# EAGLE design OPBoard (EAGLE 9.4.0)
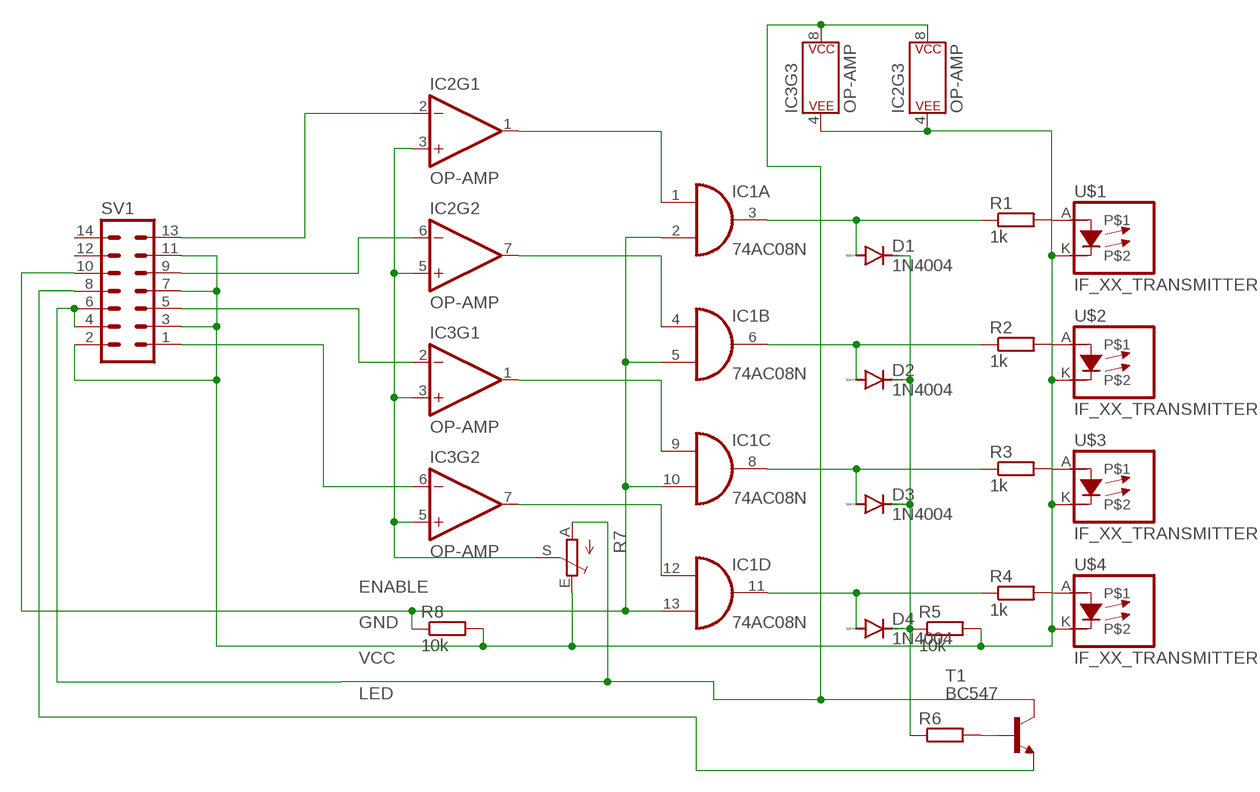
[diagram p0: schematic, sheet 1]

## Parts
D1  1N4004  [DO41-10]
D2  1N4004  [DO41-10]
D3  1N4004  [DO41-10]
D4  1N4004  [DO41-10]
IC1  74AC08N  [DIL14]
IC2  OP-AMP  OPAMP-DUALDIP  [DIP08]
IC3  OP-AMP  OPAMP-DUALDIP  [DIP08]
R1  1k  R-EU_0207/10  [0207/10]
R2  1k  R-EU_0207/10  [0207/10]
R3  1k  R-EU_0207/10  [0207/10]
R4  1k  R-EU_0207/10  [0207/10]
R5  10k  R-EU_0207/10  [0207/10]
R6  R-EU_0207/10  [0207/10]
R7  TRIM_EU-ECP10P  [ECP10P]
R8  10k  R-EU_0207/10  [0207/10]
SV1  MA07-2  [MA07-2]
T1  BC547  [TO92]
U$1  IF_XX_TRANSMITTER  [IF_XX]
U$2  IF_XX_TRANSMITTER  [IF_XX]
U$3  IF_XX_TRANSMITTER  [IF_XX]
U$4  IF_XX_TRANSMITTER  [IF_XX]

## Nets
ENABLE: IC1.2(A:I1) IC1.5(B:I1) IC1.10(C:I1) IC1.13(D:I1) R8.1 SV1.10
GND: IC2.4(P$V-) IC3.4(P$V-) R5.2 R7.E R8.2 SV1.2 SV1.3 SV1.7 SV1.11 U$1.K U$2.K U$3.K U$4.K
LED: SV1.8 T1.1(E)
N$1: R1.2 U$1.A
N$2: R2.2 U$2.A
N$3: R3.2 U$3.A
N$4: R4.2 U$4.A
N$5: D1.A IC1.3(A:O) R1.1
N$6: D2.A IC1.6(B:O) R2.1
N$7: D3.A IC1.8(C:O) R3.1
N$8: D4.A IC1.11(D:O) R4.1
N$9: D1.C D2.C D3.C D4.C R5.1 R6.1
N$10: R6.2 T1.2(B)
N$11: IC2.2(-IN) SV1.13
N$12: IC1.1(A:I0) IC2.1(OUT)
N$13: IC1.4(B:I0) IC2.7(OUT)
N$14: IC1.9(C:I0) IC3.1(OUT)
N$15: IC1.12(D:I0) IC3.7(OUT)
N$16: IC2.3(+IN) IC2.5(+IN) IC3.3(+IN) IC3.5(+IN) R7.S
N$17: IC2.6(-IN) SV1.9
N$18: IC3.2(-IN) SV1.5
N$19: IC3.6(-IN) SV1.1
VCC: IC2.8(P$V+) IC3.8(P$V+) R7.A SV1.4 SV1.6 T1.3(C)
Unconnected: SV1.12 SV1.14

## Power pins joined to a net without a drawn wire
GND: IC1.7(P:GND)
VCC: IC1.14(P:VCC)

## Library data of the parts
D1-D4 = diode:1N4004: DIODE general purpose rectifier, 1 A
IC1 = 74xx-eu:74*08: Quad 2-input AND gate
IC2 IC3 = SparkFun-IC-Amplifiers:OPAMP-DUAL: Generic op-amp footprint This component is for the standard 358 pinning of a dual op-amp From the LM358 datasheet: Pin 1: Output A Pin 2: Inverting Input A Pin 3: Non-Inverting Input A Pin 4: Gnd Pin 5: Non-Inverting Input B Pin 6: Inverting Input B Pin 7: Output B Pin 8: V+; PROD_ID: NA-XXXXX
R1-R6 R8 = rcl:R-EU_: RESISTOR, European symbol; SPICEPREFIX: R
R7 = pot:TRIM_EU-: POTENTIOMETER
SV1 = con-lstb:MA07-2: PIN HEADER; OC_FARNELL: unknown; OC_NEWARK: unknown
T1 = transistor:BC547: NPN TRANSISTOR
U$1-U$4 = Industrial_Fiberoptics:IF_XX_TRANSMITTER

## Board
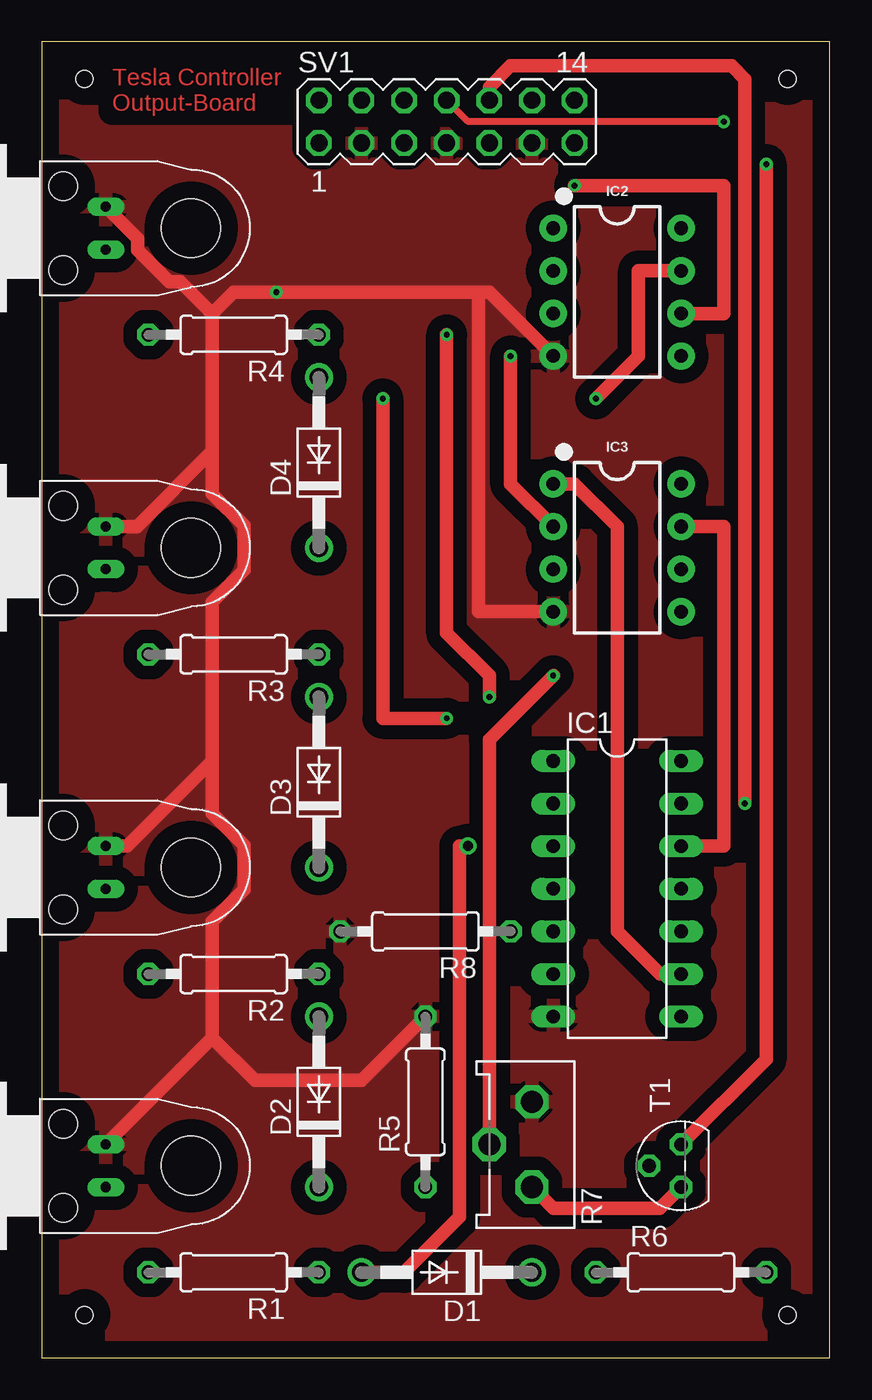
[diagram p1: board, top side]
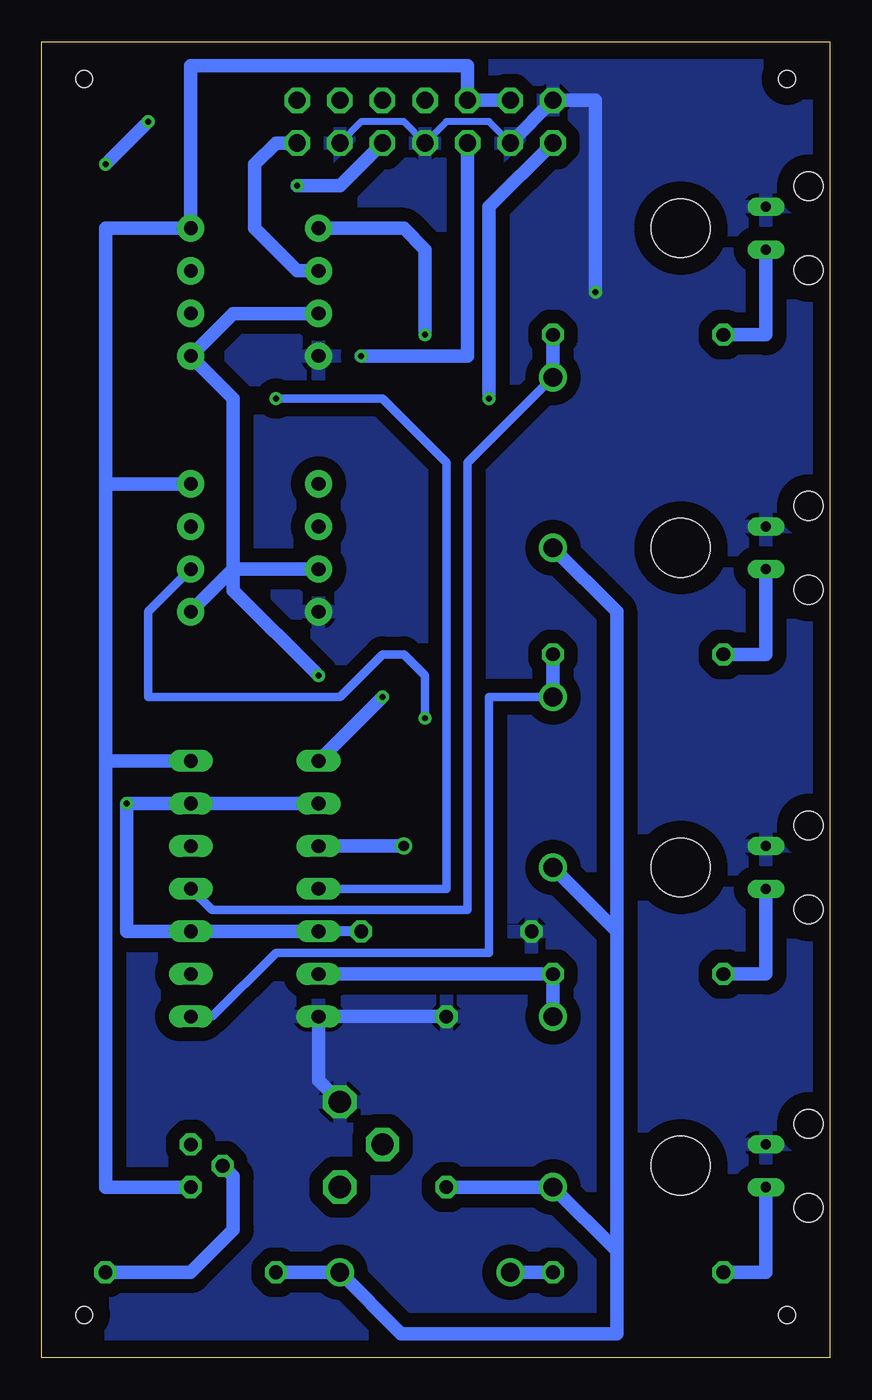
[diagram p2: board, bottom side, seen from below]

Size 46.97 x 78.41 mm. Coordinates in mm from the lower left corner, seen from the top.
Outline: 0,0 46.97,0 46.97,78.41 0,78.41 0,0
Copper layers (1*16): Top 0.035mm / dielectric 1.5mm / Bottom 0.035mm
Design rules "default": minimum track width 6mil, minimum drill 0.35mm, track to track 6mil, track to pad 6mil, pad to pad 6mil, via to via 6mil, smd to smd 6mil, copper to edge 40mil, drill to drill 6mil, minimum pad ring 10mil, minimum via ring 8mil, stop-mask expansion 4mil, vias tented up to drill 0mil, thermal gap 10mil
Holes 1 mm at 2.54,76.2 44.45,76.2 2.54,2.54 44.45,2.54

### Footprints (pad centres in the part's own frame; a part is rotated, then mirrored left to right if it is on the bottom)
DO41-10 = drill 1.118: A 5.08,0; C -5.08,0
DIL14 = drill 0.813 long: 1 -7.62,-3.81; 2 -5.08,-3.81; 3 -2.54,-3.81; 4 0,-3.81; 5 2.54,-3.81; 6 5.08,-3.81; 7 7.62,-3.81; 8 7.62,3.81; 9 5.08,3.81; 10 2.54,3.81; 11 0,3.81; 12 -2.54,3.81; 13 -5.08,3.81; 14 -7.62,3.81
DIP08 = drill 0.813 pad 1.626: 1 -3.81,-3.81; 2 -1.27,-3.81; 3 1.27,-3.81; 4 3.81,-3.81; 5 3.81,3.81; 6 1.27,3.81; 7 -1.27,3.81; 8 -3.81,3.81
0207/10 = drill 0.813 octagon: 1 -5.08,0; 2 5.08,0
ECP10P = drill 1.321 octagon: A -2.54,0; E 2.54,0; S 0,2.54
MA07-2 = drill 1.016 octagon: 1 -7.62,-1.27; 2 -7.62,1.27; 3 -5.08,-1.27; 4 -5.08,1.27; 5 -2.54,-1.27; 6 -2.54,1.27; 7 0,-1.27; 8 0,1.27; 9 2.54,-1.27; 10 2.54,1.27; 11 5.08,-1.27; 12 5.08,1.27; 13 7.62,-1.27; 14 7.62,1.27
TO92 = drill 0.813 octagon: 1 1.27,0; 2 0,1.905; 3 -1.27,0
IF_XX = drill 0.6 long: A -1.27,5.08; K 1.27,5.08 | hole 3.5: 0,0 | hole 1.7: -2.504,7.62; 2.504,7.62

### Placement (x,y rotation side)
D1  24.13,5.08 180 top
D2  16.51,15.24 90 top
D3  16.51,34.29 90 top
D4  16.51,53.34 90 top
IC1  34.29,27.94 270 top
IC2  34.29,63.5 270 top
IC3  34.29,48.26 270 top
R1  11.43,5.08 180 top
R2  11.43,22.86 180 top
R3  11.43,41.91 180 top
R4  11.43,60.96 180 top
R5  22.86,15.24 90 top
R6  38.1,5.08 0 top
R7  29.21,12.7 90 top
R8  22.86,25.4 180 top
SV1  24.13,73.66 0 top
T1  38.1,11.43 90 top
U$1  8.89,11.43 90 top
U$2  8.89,29.21 90 top
U$3  8.89,48.26 90 top
U$4  8.89,67.31 90 top

### Tracks (layer width: path | path; a pad name or v marks a point on that pad's centre or on a via)
ENABLE  (via drill 0.35)
  Top 0.813: v41.91,33.02 41.91,76.2 41.12,76.99 27.94,76.99 26.67,75.72 SV1.10
  Bottom 0.61: R8.1 IC1.5
  Bottom 0.813: IC1.2 IC1.13 v41.91,33.02 41.91,25.4 IC1.10 IC1.5
GND  (via drill 0.35)
  Top 0.813: U$4.K 5.72,66.67 5.72,66 7.58,64.14 8.25,64.14 10.16,62.23 | 10.16,62.23 10.16,54.02 | 10.16,54.02 5.67,49.53 U$3.K | 10.16,35.56 10.16,45.04 12.06,46.95 12.06,49.57 10.16,51.48 10.16,54.02 | 10.16,35.56 5.08,30.48 U$2.K | 10.16,35.56 10.16,32.43 12.06,30.52 12.06,27.9 10.16,25.99 10.16,19.05 | 10.16,19.05 U$1.K | 10.16,19.05 12.7,16.51 19.05,16.51 R5.2 | IC2.4 26.67,63.5 26.04,63.5 | 26.04,63.5 v13.97,63.5 11.43,63.5 10.16,62.23 | IC3.4 26.04,44.45 26.04,63.5
  Bottom 0.406: SV1.3 20.32,73.66 22.86,73.66 SV1.7 25.4,73.66 27.94,73.66 SV1.11
  Bottom 0.813: R5.2 IC1.7 30.48,16.51 R7.E | SV1.3 SV1.2 13.97,74.93 v13.97,63.5
  pour Top (isolate 0.813): 0,78.74 46.99,78.74 46.99,0 0,0
  pour Bottom (isolate 0.813): 0,78.74 46.99,78.74 46.99,0 0,0
LED  (via drill 0.35)
  Top 0.406: v40.64,73.66 25.4,73.66 SV1.8
  Top 0.813: T1.1 43.18,17.78 v43.18,71.12
  Bottom 0.813: v43.18,71.12 v40.64,73.66
N$1
  Bottom 0.813: U$1.A 3.81,5.08 R1.2
N$2
  Bottom 0.813: U$2.A 3.81,22.86 R2.2
N$3
  Bottom 0.813: U$3.A 3.81,41.91 R3.2
N$4
  Bottom 0.813: U$4.A 3.81,60.96 R4.2
N$5  (via drill 0.6)
  Top 0.813: v25.4,30.48 24.89,30.48 24.89,8.38 21.59,5.08 D1.A
  Bottom 0.813: R1.1 D1.A | IC1.3 v25.4,30.48
N$6
  Bottom 0.813: D2.A R2.1 IC1.6
N$7
  Bottom 0.508: D3.A 20.32,39.37 20.32,24.13 33.02,24.13 36.83,20.32 IC1.8
  Bottom 0.813: R3.1 D3.A
N$8
  Bottom 0.508: D4.A 21.59,53.34 21.59,26.67 36.83,26.67 IC1.11
  Bottom 0.813: R4.1 D4.A
N$9
  Bottom 0.813: D4.C 12.7,44.45 12.7,25.4 | 12.7,25.4 D3.C | 12.7,25.4 12.7,6.35 | 12.7,6.35 D2.C R5.1 | 12.7,6.35 12.7,1.42 25.55,1.42 D1.C R6.1
N$10
  Bottom 0.813: R6.2 38.1,5.08 35.56,7.62 35.56,10.79 T1.2
N$11
  Bottom 0.813: SV1.13 33.02,72.39 34.29,71.12 34.29,67.31 31.75,64.77 IC2.2
N$12  (via drill 0.35)
  Top 0.813: v26.67,39.37 26.67,40.64 24.13,43.18 v24.13,60.96
  Bottom 0.813: IC1.1 v26.67,39.37 | v24.13,60.96 24.13,66.04 25.4,67.31 IC2.1
N$13  (via drill 0.35)
  Top 0.813: v33.02,57.15 35.56,59.69 35.56,64.77 IC2.7
  Bottom 0.508: IC1.4 22.86,27.94 22.86,53.34 26.67,57.15 v33.02,57.15
N$14
  Top 0.813: IC3.1 31.75,52.07 34.29,49.53 34.29,25.4 36.83,22.86 IC1.9
N$15
  Top 0.813: IC1.12 40.64,30.48 40.64,49.53 IC3.7
N$16  (via drill 0.35)
  Top 0.813: v30.48,40.64 26.67,36.83 R7.S
  Bottom 0.813: 35.56,46.99 IC3.5 | IC3.3 35.56,46.99 | IC2.3 35.56,62.23 IC2.5 35.56,57.15 35.56,46.99 | v30.48,40.64 35.56,45.72 35.56,46.99
N$17  (via drill 0.35)
  Top 0.813: v31.75,69.85 40.64,69.85 40.64,62.23 IC2.6
  Bottom 0.813: SV1.9 29.21,69.85 v31.75,69.85
N$18  (via drill 0.35)
  Top 0.813: IC3.2 27.94,52.07 v27.94,59.69
  Bottom 0.813: v27.94,59.69 21.59,59.69 SV1.5
N$19  (via drill 0.35)
  Top 0.813: v20.32,57.15 20.32,38.1 v24.13,38.1
  Bottom 0.508: v24.13,38.1 24.13,40.64 25.4,41.91 26.67,41.91 29.21,39.37 40.64,39.37 40.64,44.45 IC3.6
  Bottom 0.813: SV1.1 20.32,68.58 v20.32,57.15
VCC
  Top 0.813: R7.A 30.48,8.89 36.83,8.89 T1.3
  Bottom 0.813: 43.18,52.07 43.18,67.31 IC2.8 38.1,76.99 21.59,76.99 SV1.6 SV1.4 | 43.18,52.07 IC3.8 | 43.18,52.07 43.18,35.56 | 43.18,35.56 IC1.14 | 43.18,35.56 43.18,10.16 T1.3

### Text on the board
Top: Tesla Controller / Output-Board